# Altium schematic sheet lv_controller_motor_drivers.SchDoc
size A4; SheetNumber: 3; SheetTotal: 3
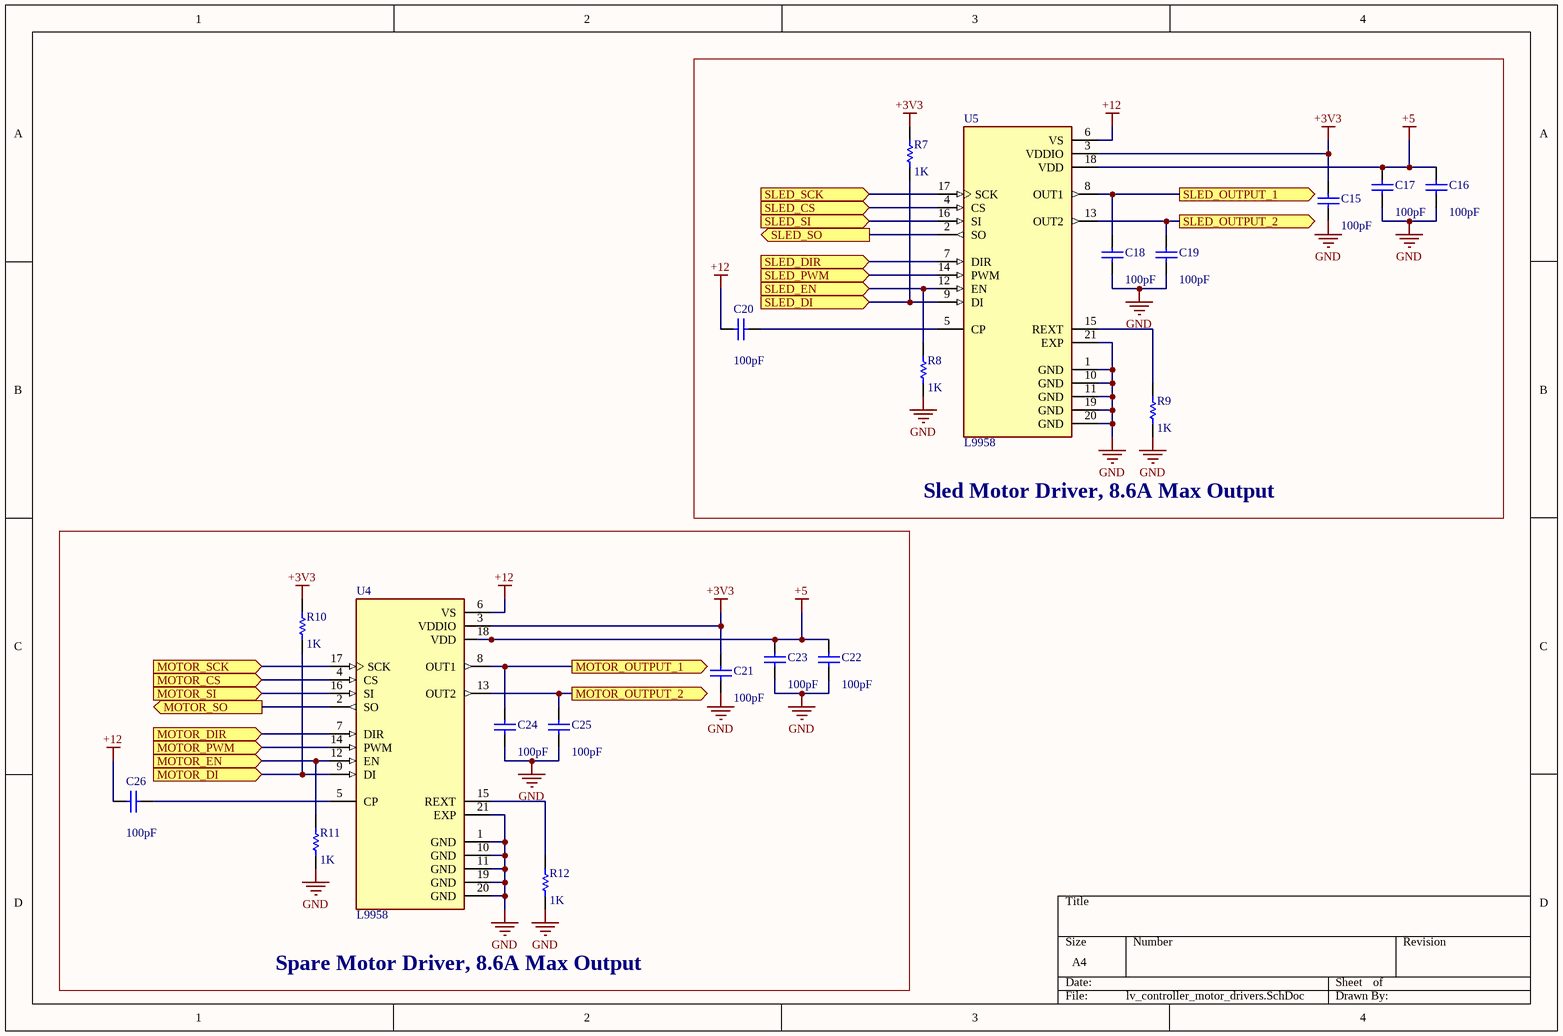
[diagram p0: lv_controller_motor_drivers.SchDoc]

## Parts
C15  value 100pF  [C0805]  (hidden comment: Cap)
C16  value 100pF  [C0805]  (hidden comment: Cap)
C17  value 100pF  [C0805]  (hidden comment: Cap)
C18  value 100pF  [C0805]  (hidden comment: Cap)
C19  value 100pF  [C0805]  (hidden comment: Cap)
C20  value 100pF  [C0805]  (hidden comment: Cap)
C21  value 100pF  [C0805]  (hidden comment: Cap)
C22  value 100pF  [C0805]  (hidden comment: Cap)
C23  value 100pF  [C0805]  (hidden comment: Cap)
C24  value 100pF  [C0805]  (hidden comment: Cap)
C25  value 100pF  [C0805]  (hidden comment: Cap)
C26  value 100pF  [C0805]  (hidden comment: Cap)
R7  value 1K  [6-0805_M]  (hidden comment: Res1)
R8  value 1K  [6-0805_M]  (hidden comment: Res1)
R9  value 1K  [6-0805_M]  (hidden comment: Res1)
R10  value 1K  [6-0805_M]  (hidden comment: Res1)
R11  value 1K  [6-0805_M]  (hidden comment: Res1)
R12  value 1K  [6-0805_M]  (hidden comment: Res1)
U4  L9958  [SOIC127P1420X360-21N]
U5  L9958  [SOIC127P1420X360-21N]

## Blocks framed on the sheet
Sled Motor Driver, 8.6A Max Output: C15-C20 R7-R9 U5
Spare Motor Driver, 8.6A Max Output: C21-C26 R10-R12 U4

## Ports
MOTOR_CS (in, see lv_controller[2B]), MOTOR_DI (in, see lv_controller[2B]), MOTOR_DIR (in, see lv_controller[2B]), MOTOR_EN (in, see lv_controller[2B]), MOTOR_OUTPUT_1 (out, see lv_controller[3D]), MOTOR_OUTPUT_2 (out, see lv_controller[3D]), MOTOR_PWM (in, see lv_controller[2B]), MOTOR_SCK (in, see lv_controller[2B]), MOTOR_SI (in, see lv_controller[2B]), MOTOR_SO (out, see lv_controller[2B]), SLED_CS (in, see lv_controller[2B]), SLED_DI (in, see lv_controller[2A]), SLED_DIR (in, see lv_controller[2A]), SLED_EN (in, see lv_controller[2A]), SLED_OUTPUT_1 (out, see lv_controller[3C]), SLED_OUTPUT_2 (out, see lv_controller[3C]), SLED_PWM (in, see lv_controller[2A]), SLED_SCK (in, see lv_controller[2B]), SLED_SI (in, see lv_controller[2B]), SLED_SO (out, see lv_controller[2B])

## Nets
+3V3: C15.2 C21.2 R7.1 R10.1 U4.3(VDDIO) U5.3(VDDIO)
+5: C16.2 C17.2 C22.2 C23.2 U4.18(VDD) U5.18(VDD)
+12: C20.1 C26.1 U4.6(VS) U5.6(VS)
GND: C15.1 C16.1 C17.1 C18.1 C19.1 C21.1 C22.1 C23.1 C24.1 C25.1 R8.2 R9.2 R11.2 R12.2 U4.1(GND) U4.10(GND) U4.11(GND) U4.19(GND) U4.20(GND) U4.21(EXP) U5.1(GND) U5.10(GND) U5.11(GND) U5.19(GND) U5.20(GND) U5.21(EXP)
MOTOR_CS: U4.4(CS) ; port MOTOR_CS
MOTOR_DI: R10.2 U4.9(DI) ; port MOTOR_DI
MOTOR_DIR: U4.7(DIR) ; port MOTOR_DIR
MOTOR_EN: R11.1 U4.12(EN) ; port MOTOR_EN
MOTOR_OUTPUT_1: C24.2 U4.8(OUT1) ; port MOTOR_OUTPUT_1
MOTOR_OUTPUT_2: C25.2 U4.13(OUT2) ; port MOTOR_OUTPUT_2
MOTOR_PWM: U4.14(PWM) ; port MOTOR_PWM
MOTOR_SCK: U4.17(SCK) ; port MOTOR_SCK
MOTOR_SI: U4.16(SI) ; port MOTOR_SI
MOTOR_SO: U4.2(SO) ; port MOTOR_SO
SLED_CS: U5.4(CS) ; port SLED_CS
SLED_DI: R7.2 U5.9(DI) ; port SLED_DI
SLED_DIR: U5.7(DIR) ; port SLED_DIR
SLED_EN: R8.1 U5.12(EN) ; port SLED_EN
SLED_OUTPUT_1: C18.2 U5.8(OUT1) ; port SLED_OUTPUT_1
SLED_OUTPUT_2: C19.2 U5.13(OUT2) ; port SLED_OUTPUT_2
SLED_PWM: U5.14(PWM) ; port SLED_PWM
SLED_SCK: U5.17(SCK) ; port SLED_SCK
SLED_SI: U5.16(SI) ; port SLED_SI
SLED_SO: U5.2(SO) ; port SLED_SO
NetC20_2: C20.2 U5.5(CP)
NetC26_2: C26.2 U4.5(CP)
NetR9_1: R9.1 U5.15(REXT)
NetR12_1: R12.1 U4.15(REXT)

## Library data of the parts
C15-C26 = Cap: Capacitor; Published: 8-Jun-2000; LatestRevisionDate: 17-Jul-2002; LatestRevisionNote: Re-released for DXP Platform.; PackageReference: RAD-0.3; Publisher: Altium Limited; PackageDescription: Radial Cap, Thru-Hole; 2 Leads; 0.3 in Pin Spacing
R7-R12 = Res1: Resistor; Published: 8-Jun-2000; LatestRevisionDate: 17-Jul-2002; LatestRevisionNote: Re-released for DXP Platform.; PackageReference: AXIAL-0.3; Publisher: Altium Limited; PackageDescription: Axial Device, Thru-Hole; 2 Leads; 0.3 in Pin Spacing
U4 U5 = L9958: Bipolar Motor Driver CMOS SPI PowerSO-16â„¢; MF: STMicroelectronics; SnapEDA_Link: https://www.snapeda.com/parts/L9958/STMicroelectronics/view-part/213961/?ref=snap; Availability: Unavailable; MP: L9958; Package: SO-20 STMicroelectronics; Price: None; Value: *